# Altium schematic sheet Top.SchDoc
size A4
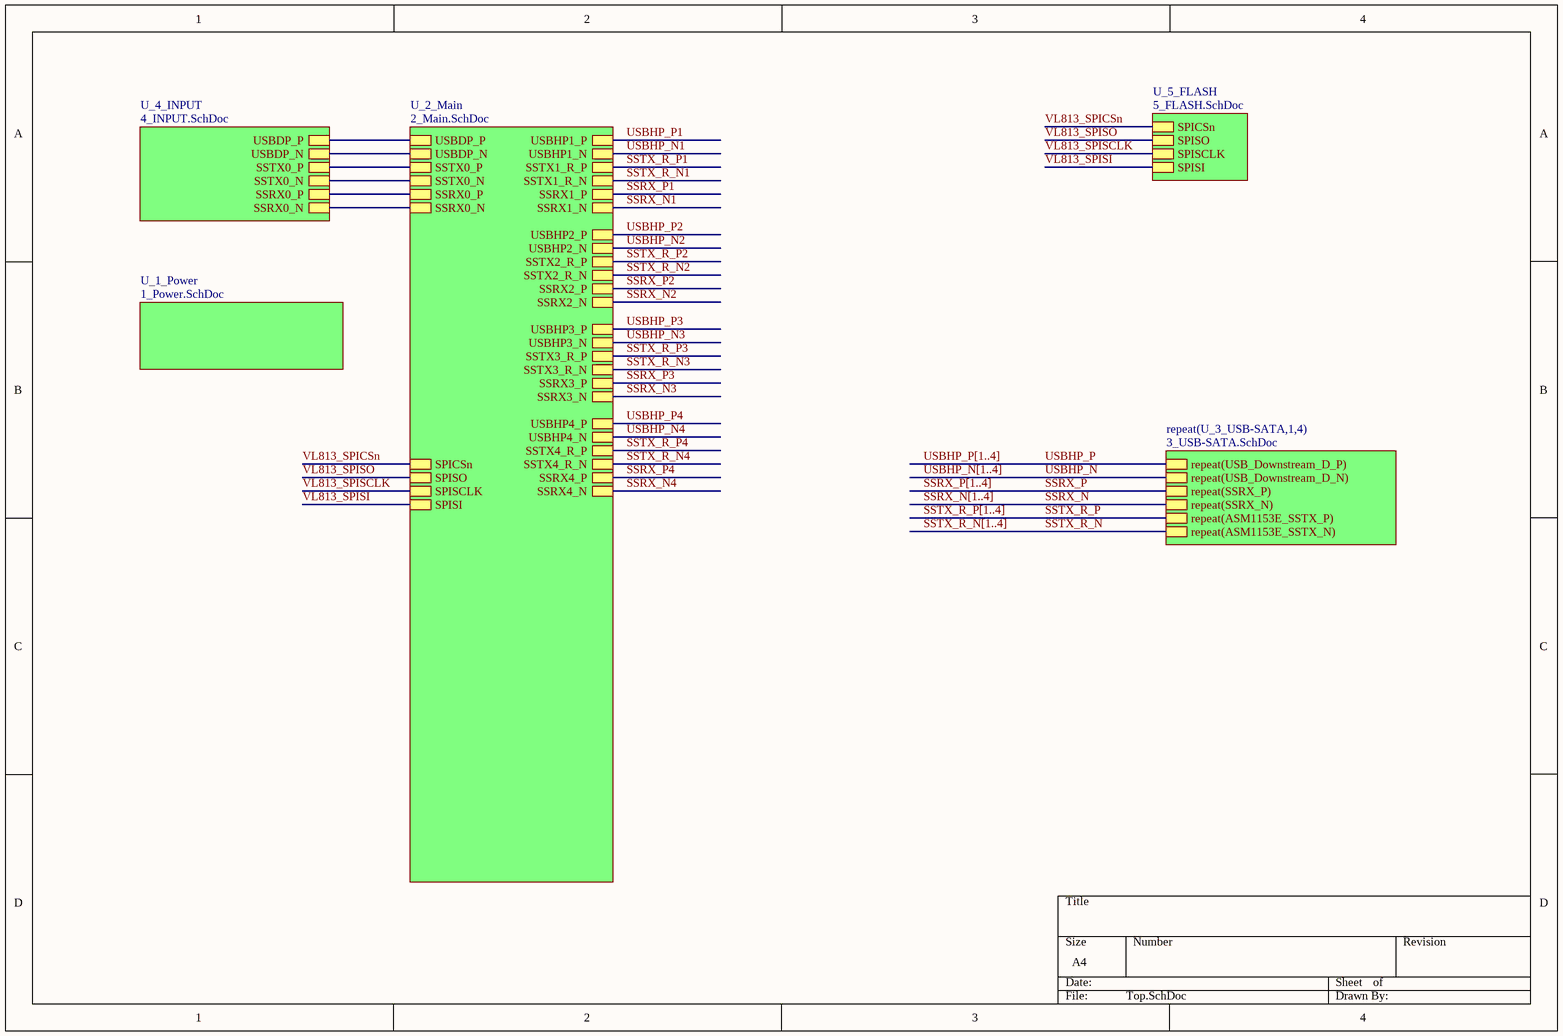
[diagram p0: Top.SchDoc]

## Sub-sheets
repeat(U_3_USB-SATA,1,4) = 3_USB-SATA.SchDoc: repeat(USB_Downstream_D_P), repeat(USB_Downstream_D_N), repeat(ASM1153E_SSTX_P), repeat(ASM1153E_SSTX_N), repeat(SSRX_N), repeat(SSRX_P)
U_1_Power = 1_Power.SchDoc: no entries
U_2_Main = 2_Main.SchDoc: USBHP1_N, USBHP1_P, SSRX1_N, SSRX1_P, SSTX1_R_N, SSTX1_R_P, USBHP2_N, USBHP2_P, SSRX2_N, SSRX2_P, SSTX2_R_N, SSTX2_R_P, USBHP3_N, USBHP3_P, SSRX3_N, SSRX3_P, SSTX3_R_N, SSTX3_R_P, USBHP4_N, USBHP4_P, SSRX4_N, SSRX4_P, SSTX4_R_N, SSTX4_R_P, SPICSn, SPISO, SPISCLK, SPISI, USBDP_P, USBDP_N, SSTX0_N, SSTX0_P, SSRX0_N, SSRX0_P
U_4_INPUT = 4_INPUT.SchDoc: USBDP_P, USBDP_N, SSTX0_N, SSTX0_P, SSRX0_N, SSRX0_P
U_5_FLASH = 5_FLASH.SchDoc: SPICSn, SPISO, SPISCLK, SPISI

## Nets
SSRX_N: sheet repeat(U_3_USB-SATA,1,4)/repeat(SSRX_N)
SSRX_N1: sheet U_2_Main/SSRX1_N
SSRX_N2: sheet U_2_Main/SSRX2_N
SSRX_N3: sheet U_2_Main/SSRX3_N
SSRX_N4: sheet U_2_Main/SSRX4_N
SSRX_P: sheet repeat(U_3_USB-SATA,1,4)/repeat(SSRX_P)
SSRX_P1: sheet U_2_Main/SSRX1_P
SSRX_P2: sheet U_2_Main/SSRX2_P
SSRX_P3: sheet U_2_Main/SSRX3_P
SSRX_P4: sheet U_2_Main/SSRX4_P
SSTX_R_N: sheet repeat(U_3_USB-SATA,1,4)/repeat(ASM1153E_SSTX_N)
SSTX_R_N1: sheet U_2_Main/SSTX1_R_N
SSTX_R_N2: sheet U_2_Main/SSTX2_R_N
SSTX_R_N3: sheet U_2_Main/SSTX3_R_N
SSTX_R_N4: sheet U_2_Main/SSTX4_R_N
SSTX_R_P: sheet repeat(U_3_USB-SATA,1,4)/repeat(ASM1153E_SSTX_P)
SSTX_R_P1: sheet U_2_Main/SSTX1_R_P
SSTX_R_P2: sheet U_2_Main/SSTX2_R_P
SSTX_R_P3: sheet U_2_Main/SSTX3_R_P
SSTX_R_P4: sheet U_2_Main/SSTX4_R_P
USBHP_N: sheet repeat(U_3_USB-SATA,1,4)/repeat(USB_Downstream_D_N)
USBHP_N1: sheet U_2_Main/USBHP1_N
USBHP_N2: sheet U_2_Main/USBHP2_N
USBHP_N3: sheet U_2_Main/USBHP3_N
USBHP_N4: sheet U_2_Main/USBHP4_N
USBHP_P: sheet repeat(U_3_USB-SATA,1,4)/repeat(USB_Downstream_D_P)
USBHP_P1: sheet U_2_Main/USBHP1_P
USBHP_P2: sheet U_2_Main/USBHP2_P
USBHP_P3: sheet U_2_Main/USBHP3_P
USBHP_P4: sheet U_2_Main/USBHP4_P
VL813_SPICSn: sheet U_5_FLASH/SPICSn, sheet U_2_Main/SPICSn
VL813_SPISCLK: sheet U_5_FLASH/SPISCLK, sheet U_2_Main/SPISCLK
VL813_SPISI: sheet U_5_FLASH/SPISI, sheet U_2_Main/SPISI
VL813_SPISO: sheet U_5_FLASH/SPISO, sheet U_2_Main/SPISO
(unnamed): sheet U_4_INPUT/USBDP_P, sheet U_2_Main/USBDP_P
(unnamed): sheet U_4_INPUT/USBDP_N, sheet U_2_Main/USBDP_N
(unnamed): sheet U_4_INPUT/SSTX0_N, sheet U_2_Main/SSTX0_N
(unnamed): sheet U_4_INPUT/SSTX0_P, sheet U_2_Main/SSTX0_P
(unnamed): sheet U_4_INPUT/SSRX0_N, sheet U_2_Main/SSRX0_N
(unnamed): sheet U_4_INPUT/SSRX0_P, sheet U_2_Main/SSRX0_P

## Buses and harness runs
bus SSRX_N[1..4]
bus SSRX_P[1..4]
bus SSTX_R_N[1..4]
bus SSTX_R_P[1..4]
bus USBHP_N[1..4]
bus USBHP_P[1..4]